# Altium schematic sheet BK1096_USB.SchDoc: =project_title
size Tabloid; PageSetup: Record=PageOptions|CenterHorizontal=True|CenterVertical=True|PrintScale=0.73|XCorrection=1.00|YCorrection=1.00|PrintKind=0|BorderSize=5000000|LeftOffset=0|BottomOffset=0|Orientation=2|PaperLength=1000|PaperWidth=1000|Scale=100|PaperSource=7|PrintQuality=-4|MediaType=1|DitherType=10|PaperKind=A4|PrintScaleMode=1; CompanyName: Luxonis Holding; Organization: Luxonis Holding; Address1: 1925 Harmony Park Drive; Address2: Westminster, CO; Address3: 80234; Address4: United States; SheetNumber: 6; SheetTotal: 6
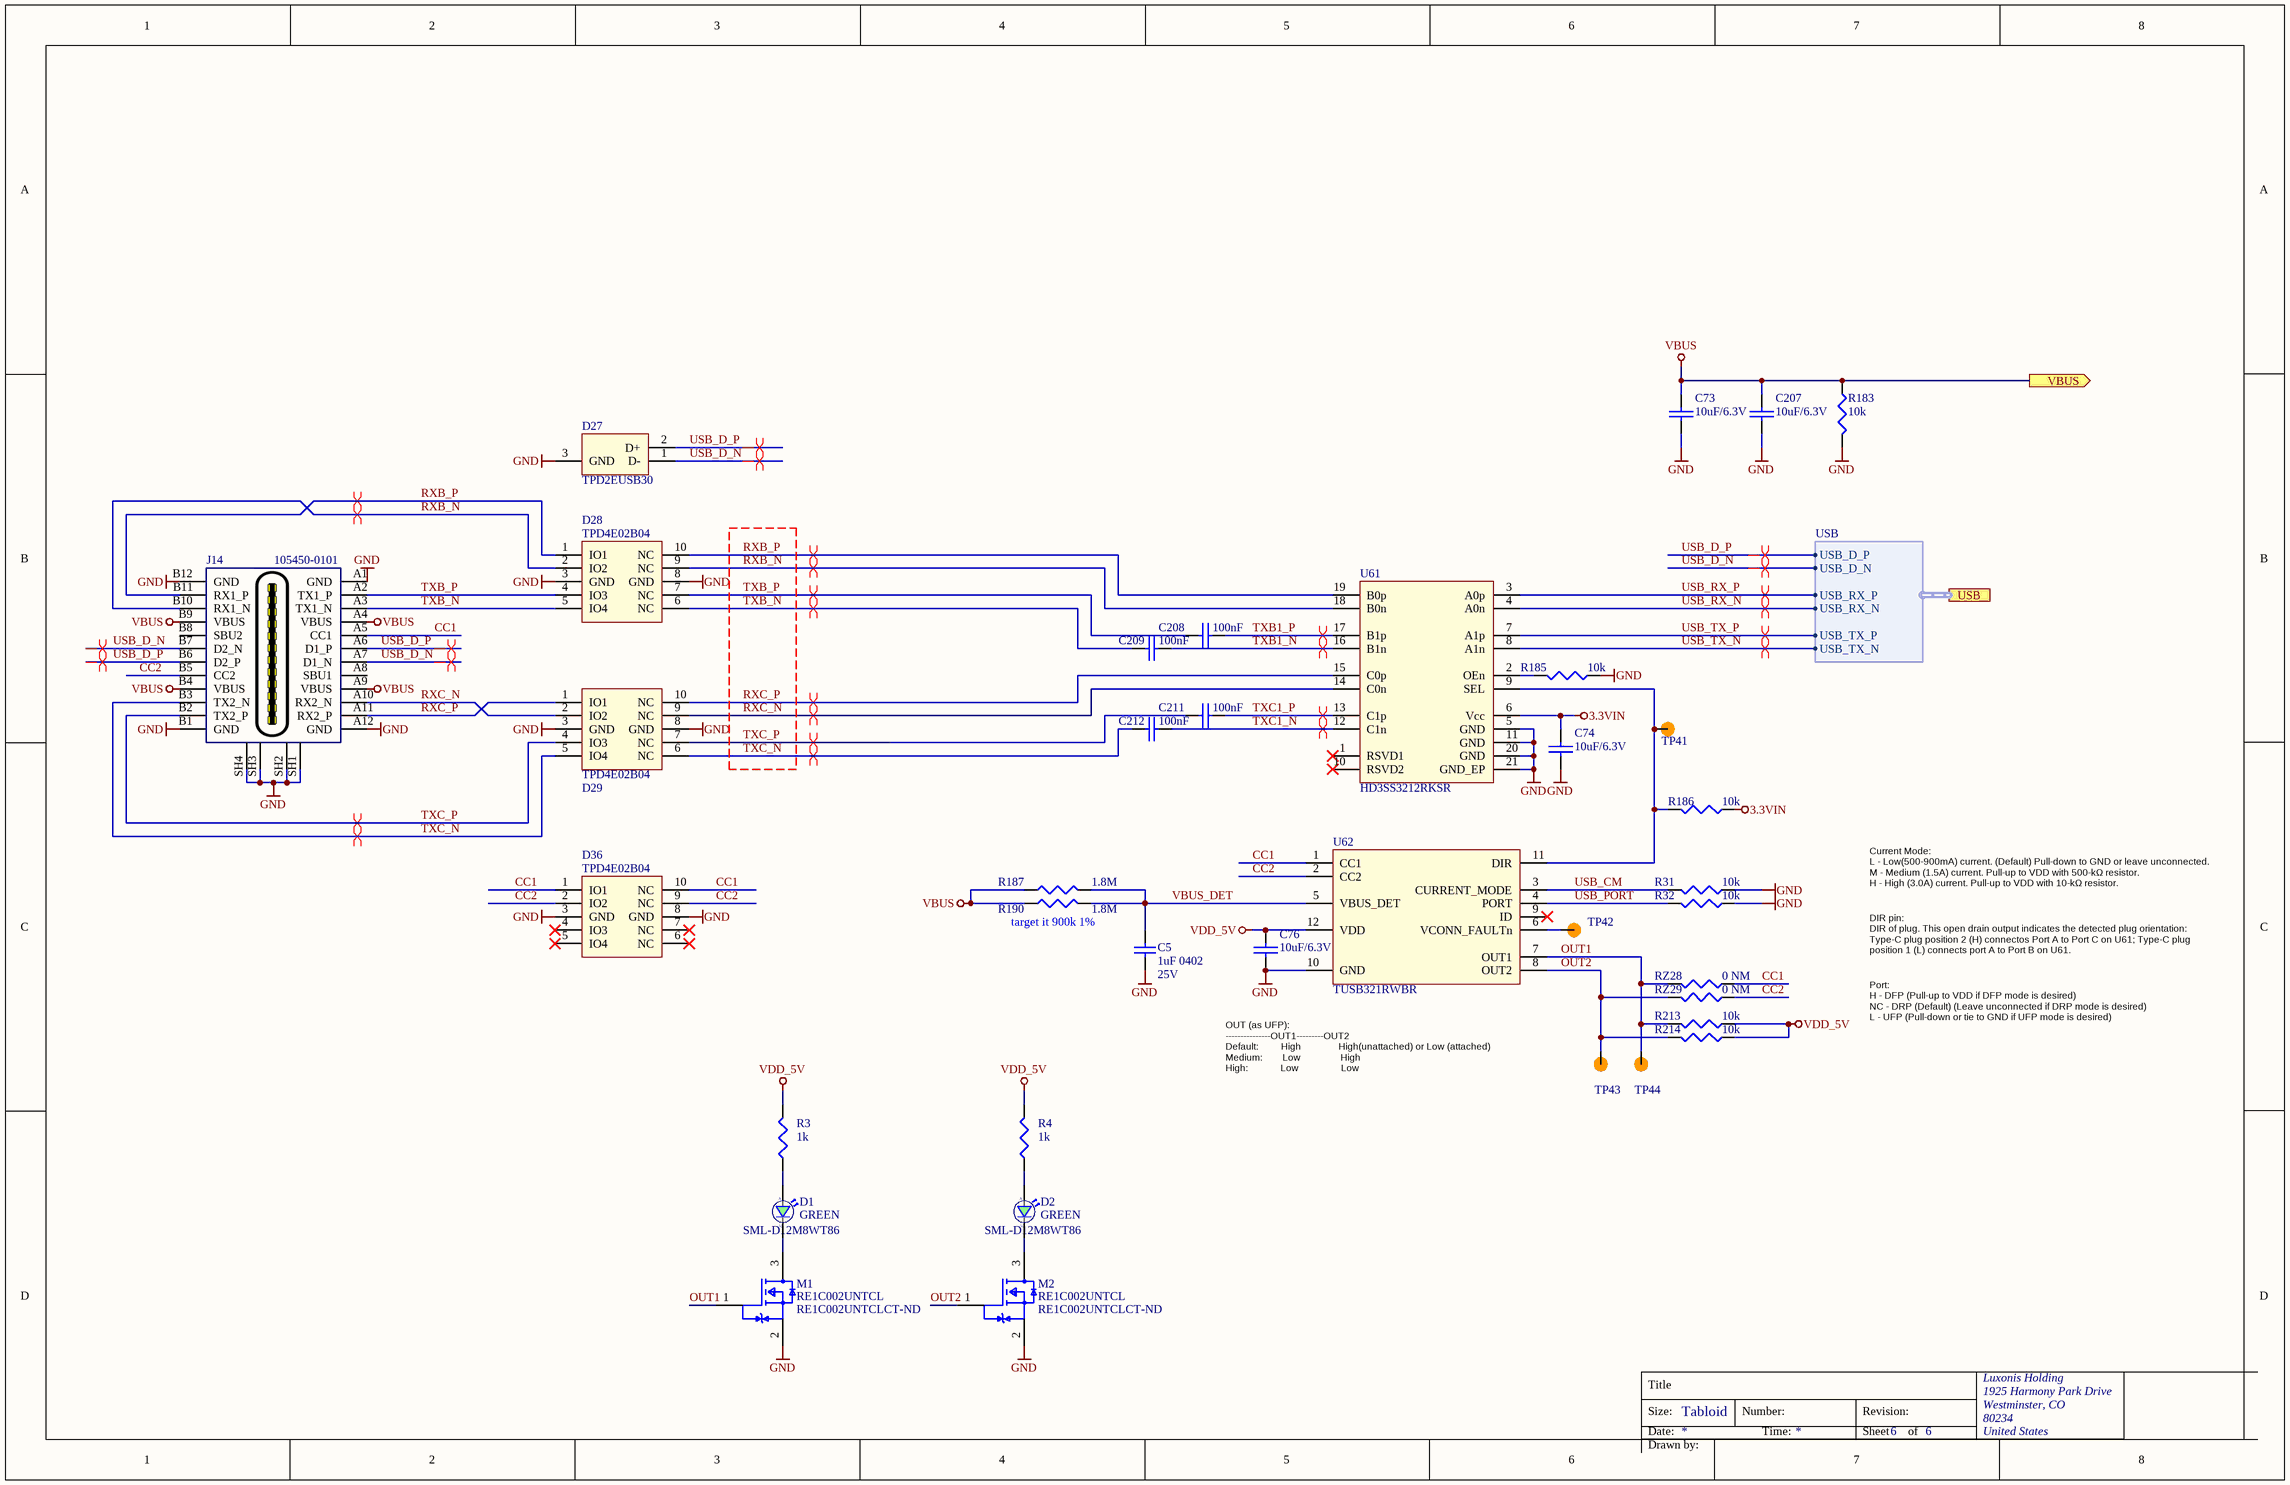
[diagram p0: BK1096_USB.SchDoc]

## Parts
C5  1uF 0402  Voltage Rating: 25V  [CAPC0402(1005)70_N]
C73  10uF/6.3V  [CAPC0402(1005)60_N]
C74  10uF/6.3V  [CAPC0402(1005)60_N]
C76  10uF/6.3V  [CAPC0402(1005)60_N]
C207  10uF/6.3V  [CAPC0402(1005)60_N]
C208  100nF  [CAPC0201(0603)33_L]
C209  100nF  [CAPC0201(0603)33_L]
C211  100nF  [CAPC0201(0603)33_L]
C212  100nF  [CAPC0201(0603)33_L]
D1  GREEN  Manufacturer Part Number: SML-D12M8WT86  [LED_0603]
D2  GREEN  Manufacturer Part Number: SML-D12M8WT86  [LED_0603]
D27  TPD2EUSB30  [SOT-3]
D28  TPD4E02B04  [DQA-10]
D29  TPD4E02B04  [DQA-10]
D36  TPD4E02B04  [DQA-10]
J14  105450-0101  [Molex_105450-0101]
M1  RE1C002UNTCL  Supplier Part Number 1: RE1C002UNTCLCT-ND  [SOT-416FL]
M2  RE1C002UNTCL  Supplier Part Number 1: RE1C002UNTCLCT-ND  [SOT-416FL]
R3  1k  [RESC0402(1005)_N]
R4  1k  [RESC0402(1005)_N]
R31  10k  [RESC0402(1005)_N]
R32  10k  [RESC0402(1005)_N]
R183  10k  [RESC0402(1005)_N]
R185  10k  [RESC0402(1005)_N]
R186  10k  [RESC0402(1005)_N]
R187  1.8M  [RESC0402(1005)_N]
R190  1.8M  [RESC0402(1005)_N]
R213  10k  [RESC0402(1005)_N]
R214  10k  [RESC0402(1005)_N]
RZ28  0 NM  [RESC0603(1608)_N]
RZ29  0 NM  [RESC0603(1608)_N]
TP41  TP_SMD  [TP_0.75MM_SMD_NO-SILK]  (value not drawn)  (no BOM)
TP42  TP_SMD  [TP_0.75MM_SMD_NO-SILK]  (value not drawn)  (no BOM)
TP43  TP_SMD  [TP_0.75MM_SMD_NO-SILK]  (value not drawn)  (no BOM)
TP44  TP_SMD  [TP_0.75MM_SMD_NO-SILK]  (value not drawn)  (no BOM)
U61  HD3SS3212RKSR  [VQFN-20]
U62  TUSB321RWBR  [X2QFN-12]

## Ports
USB (harness USB), VBUS (out)

## Harnesses
USB: USB_D_P, USB_D_N, USB_TX_N, USB_TX_P, USB_RX_N, USB_RX_P

## Nets
3.3VIN: C74.2 R186.2 U61.6(Vcc)
GND: C5.1 C73.1 C74.1 C76.1 C207.1 D27.3(GND) D28.3(GND) D28.8(GND) D29.3(GND) D29.8(GND) D36.3(GND) D36.8(GND) J14.A1(GND) J14.A12(GND) J14.B1(GND) J14.B12(GND) J14.SH1(SH) J14.SH2(SH) J14.SH3(SH) J14.SH4(SH) M1.2(Source) M2.2(Source) R31.2 R32.2 R183.1 R185.2 U61.5(GND) U61.11(GND) U61.20(GND) U61.21(GND_EP) U62.10(GND)
VBUS: C73.2 C207.2 J14.A4(VBUS) J14.A9(VBUS) J14.B4(VBUS) J14.B9(VBUS) R183.2 R187.2 R190.2 ; port VBUS
VDD_5V: C76.2 R3.2 R4.2 R213.2 R214.2 U62.12(VDD)
CC1: D36.1(IO1) D36.10(NC) J14.A5(CC1) RZ28.1 U62.1(CC1)
CC2: D36.2(IO2) D36.9(NC) J14.B5(CC2) RZ29.1 U62.2(CC2)
OUT1: M1.1(Gate) R213.1 RZ28.2 TP44.1 U62.7(OUT1)
OUT2: M2.1(Gate) R214.1 RZ29.2 TP43.1 U62.8(OUT2)
RXB_N: D28.2(IO2) D28.9(NC) J14.B10(RX1_N) U61.18(B0n)
RXB_P: D28.1(IO1) D28.10(NC) J14.B11(RX1_P) U61.19(B0p)
RXC_N: D29.2(IO2) D29.9(NC) J14.A10(RX2_N) U61.14(C0n)
RXC_P: D29.1(IO1) D29.10(NC) J14.A11(RX2_P) U61.15(C0p)
TXB1_N: C209.1 U61.16(B1n)
TXB1_P: C208.1 U61.17(B1p)
TXB_N: C209.2 D28.5(IO4) D28.6(NC) J14.A3(TX1_N)
TXB_P: C208.2 D28.4(IO3) D28.7(NC) J14.A2(TX1_P)
TXC1_N: C212.1 U61.12(C1n)
TXC1_P: C211.1 U61.13(C1p)
TXC_N: C212.2 D29.5(IO4) D29.6(NC) J14.B3(TX2_N)
TXC_P: C211.2 D29.4(IO3) D29.7(NC) J14.B2(TX2_P)
USB_CM: R31.1 U62.3(CURRENT_MODE)
USB_D_N: D27.1(D-) J14.A7(D1_N) J14.B7(D2_N) ; port USB.USB_D_N
USB_D_P: D27.2(D+) J14.A6(D1_P) J14.B6(D2_P) ; port USB.USB_D_P
USB_PORT: R32.1 U62.4(PORT)
USB_RX_N: U61.4(A0n) ; port USB.USB_RX_N
USB_RX_P: U61.3(A0p) ; port USB.USB_RX_P
USB_TX_N: U61.8(A1n) ; port USB.USB_TX_N
USB_TX_P: U61.7(A1p) ; port USB.USB_TX_P
VBUS_DET: C5.2 R187.1 R190.1 U62.5(VBUS_DET)
NetD1_1: D1.1(C) M1.3(Drain)
NetD1_2: D1.2(A) R3.1
NetD2_1: D2.1(C) M2.3(Drain)
NetD2_2: D2.2(A) R4.1
NetR185_1: R185.1 U61.2(OEn)
NetR186_1: R186.1 TP41.1 U61.9(SEL) U62.11(DIR)
NetTP42_1: TP42.1 U62.6(VCONN_FAULTn)

Not connected (* = marked no-connect by the designer): D36 4(IO3)* 5(IO4)* 6(NC)* 7(NC)*; J14 A8(SBU1) B8(SBU2); U61 1(RSVD1)* 10(RSVD2)*; U62 9(ID)*

## Layout directives
differential pair; differential pair class USB3: RXB_N, RXB_P, RXC_N, RXC_P, TXB1_N, TXB1_P, TXB_N, TXB_P, TXC1_N, TXC1_P, TXC_N, TXC_P, USB_RX_N, USB_RX_P, USB_TX_N, USB_TX_P
differential pair; differential pair class USB_D: USB_D_N, USB_D_P

## Notes on the sheet
- Current Mode:
  L - Low(500-900mA) current. (Default) Pull-down to GND or leave unconnected.
  M - Medium (1.5A) current. Pull-up to VDD with 500-kΩ resistor.
  H - High (3.0A) current. Pull-up to VDD with 10-kΩ resistor.
- (near R190) target it 900k 1%
- DIR pin:
  DIR of plug. This open drain output indicates the detected plug orientation: Type-C plug position 2 (H) connectos Port A to Port C on U61; Type-C plug position 1 (L) connects port A to Port B on U61.
- Port:
  H - DFP (Pull-up to VDD if DFP mode is desired)
  NC - DRP (Default) (Leave unconnected if DRP mode is desired)
  L - UFP (Pull-down or tie to GND if UFP mode is desired)
- OUT (as UFP):
  ---------------OUT1---------OUT2
  Default:         High               High(unattached) or Low (attached)
  Medium:        Low                High
  High:             Low                 Low
- Title
- Size:
- Date:
- Tabloid
- Number:
- Time:
- Revision:
- Sheet
- of
- Drawn by:

## Library data of the parts
C5 = GRM155R61E105KA12D: CAP CER 1UF 25V X5R 0402 10%; Manufacturer 1: Murata; Material: Ceramic; Supplier 1: Digi-Key; Manufacturer Part Number 1: GRM155R61E105KA12D; Stock 1: 200653; Pricing 1: 1=0.10000, 10=0.07100, 100=0.03350, 500=0.02352, 1000=0.01947, 2500=0.01812, 5000=0.01658 (USD); RoHS: Yes; Mount: Surface Mount; Case/Package: 0402; Weight: 0.000212oz; Case Code (Metric): 1005; Case Code (Imperial): 0402; Min Operating Temperature: -55°C; Max Operating Temperature: 85°C; Tolerance: 10%; Capacitance: 1uF; Dielectric: X5R; Voltage Rating (DC): 25V; Packaging: Tape and Reel; Package Quantity: 10000; Termination: SMD/SMT; Voltage: 25V; Length: 1mm; Height: 0.5mm; Width: 0.5mm; Thickness: 0.022inch; Depth: 0.5mm; Lead Free: Lead Free; REACH SVHC: No SVHC; ComponentLink1URL: https://datasheet.ciiva.com/22732/1666664-22732122.pdf?src-supplier=Element14; ComponentLink1Description: https://datasheet.ciiva.com/22732/1666664-22732122.pdf?src-supplier=Element14; ComponentLink2URL: https://datasheet.ciiva.com/7719/1666664-7719006.pdf?src-supplier=Element14; ComponentLink2Description: https://datasheet.ciiva.com/7719/1666664-7719006.pdf?src-supplier=Element14; Supplier Part Number 1: 490-10017-1-ND; Supplier 2: Arrow; Supplier 3: TTI; Supplier Part Number 2: GRM155R61E105KA12D; Supplier Part Number 3: GRM155R61E105KA12D
C73 C74 C76 C207 = CAP: SMD Multilayer Ceramic Capacitor, 0402 [1005 Metric], 10 µF, 6.3 V, ± 20%, X5R; E - MFG: MuRata; F - MFG P/N: GRM155R60J106ME44D; D - my Footprint: CAPC0402(1005)60_N
C208 C209 C211 C212 = CAP: SMD Multilayer Ceramic Capacitor, 0201 [0603 Metric], 0.1 µF, 6.3 V, ± 10%, X5R; B - Value: 0.1uF; C - Notes: 0201  0.1 µF, 6.3 V, ± 10%, X5R; E - MFG: MuRata; F - MFG P/N: GRM033R60J104KE19D; D - my Footprint: CAPC0201(0603)33_L
D1 D2 = LED_GREEN_0603: LED GREEN DIFFUSED 0603 SMD; Manufacturer: Rohm; Colour: Green,Yellow; Lens Colour: White,Clear,Diffused; Lens Style: Diffused,Colorless,Rectangular; Forward Current: 20mA; Forward Voltage: 2.2V; Luminous Intensity: 25mcd; Dominant Wavelength: 572nm; Number of LEDs: 1; Viewing Angle: 160°; Supplier 1: Mouser; Stock 1: 109326; Pricing 1: 1=0.32, 10=0.216, 50=0.216, 100=0.09, 1000=0.062, 10000=0.041 (USD); Mount: Surface Mount; Case/Package: 0603; Number of Pins: 2; Case Code (Metric): 1608; Case Code (Imperial): 0603; Min Operating Temperature: -40°C; Max Operating Temperature: 85°C; Packaging: Tape and Reel; Wavelength: 572nm; Illumination Colour: Green; Package Quantity: 1; Test Current: 20mA; Lens Transparency: Diffused; Length: 1.6mm; Height: 0.65mm; Width: 0.8mm; Radiation Hardening: No; REACH SVHC: Unknown; Lead Free: Lead Free; ComponentLink1URL: https://datasheet.ciiva.com/11774/0900766b80df3ada-11774260.pdf; ComponentLink1Description: https://datasheet.ciiva.com/11774/0900766b80df3ada-11774260.pdf; ComponentLink2URL: https://datasheet.ciiva.com/3161/sml-d1-3161419.pdf; ComponentLink2Description: https://datasheet.ciiva.com/3161/sml-d1-3161419.pdf; ComponentLink3URL: https://datasheet.ciiva.com/2110/sml-d1-2110396.pdf; ComponentLink3Description: https://datasheet.ciiva.com/2110/sml-d1-2110396.pdf; ComponentLink4URL: https://datasheet.ciiva.com/2110/sml-d1-2110397.pdf; ComponentLink4Description: https://datasheet.ciiva.com/2110/sml-d1-2110397.pdf; ComponentLink5URL: https://datasheet.ciiva.com/2110/sml-d1-2110398.pdf; ComponentLink5Description: https://datasheet.ciiva.com/2110/sml-d1-2110398.pdf
D27 = TPD2EUSB30: DIODE, ESD, DUAL, USB3.0, SOT-3; E - MFG: TI; F - MFG P/N: TPD2EUSB30ADRTR; D - my Footprint: SOT-3
D28 D29 D36 = TPD4E02B04: TVS DIODE 3.6VWM 8.8VC 10USON; E - MFG: TI; F - MFG P/N: TPD4E02B04DQAR; D - my Footprint: DQA-10
J14 = Molex_1054500101: USB 3.1 Type C Receptacle SMD RA; E - MFG: Molex; D - my Footprint: Molex_105450-0101; F - MFG P/N: 105450-0101
M1 M2 = RE1C002UNTCL: MOSFET N-CH 20V 0.2A EMT3; Manufacturer 1: Rohm; Continuous Drain Current (ID): 200mA; Rds On Max: 1.2R; Input Capacitance: 25pF; Max Power Dissipation: 150mW; Supplier 1: Digi-Key; Manufacturer Part Number 1: RE1C002UNTCL; Stock 1: 941425; Pricing 1: 1=0.20000, 10=0.18200, 100=0.09930, 500=0.06112, 1000=0.04167 (USD); RoHS: Yes; Mount: Surface Mount; Case/Package: SOT-89; Packaging: Tape and Reel; Drain to Source Voltage (Vdss): 20V; Lead Free: Lead Free; ComponentLink1URL: http://www.mouser.com/ds/2/348/re1c002untcl-e-1018231.pdf?src-supplier=Mouser; ComponentLink1Description: http://www.mouser.com/ds/2/348/re1c002untcl-e-1018231.pdf?src-supplier=Mouser; ComponentLink2URL: http://rohmfs.rohm.com/en/techdata_basic/transistor/taping/EMT3_TL_taping.pdf?src-supplier=Digi-Key; ComponentLink2Description: http://rohmfs.rohm.com/en/techdata_basic/transistor/taping/EMT3_TL_taping.pdf?src-supplier=Digi-Key; ComponentLink3URL: http://rohmfs.rohm.com/en/products/databook/datasheet/discrete/transistor/mosfet/re1c002un.pdf?src-supplier=Avnet; ComponentLink3Description: http://rohmfs.rohm.com/en/products/databook/datasheet/discrete/transistor/mosfet/re1c002un.pdf?src-supplier=Avnet; ComponentLink4URL: https://www.rohm.com/datasheet/RE1C002UN/re1c002untcl-e?src-supplier=Digi-Key; ComponentLink4Description: https://www.rohm.com/datasheet/RE1C002UN/re1c002untcl-e?src-supplier=Digi-Key; ComponentLink5URL: http://www.farnell.com/datasheets/2704376.pdf?src-supplier=Newark; ComponentLink5Description: http://www.farnell.com/datasheets/2704376.pdf?src-supplier=Newark
R3 R4 = RES1: SMD Chip Resistor, 1 kohm, 50 V, 0402 [1005 Metric], 62.5 mW, ± 1%; E - MFG: WALSIN; F - MFG P/N: WR04X1001FTL; D - my Footprint: RESC0402(1005)_N
R31 R32 R183 R185 R186 R213 R214 = RES1: SMD Chip Resistor, Thick Film, 10 kohm, 50 V, 0402, 100mW, ± 1%; E - MFG: Panasonic; F - MFG P/N: ERJ2RKF1002X; D - my Footprint: RESC0402(1005)_N
R187 R190 = R_1.8M_1%_0402: RES SMD 1.8M 1% 0402 50V; E - MFG: YAGEO (PHYCOMP); F - MFG P/N: RC0402FR-071M8L; D - my Footprint: RESC0402(1005)_N
RZ28 RZ29 = RES1: Thick Film Resistors - SMD 0603 Zero Ohms; E - MFG: Panasonic; F - MFG P/N: ERJ-3GEY0R00V; D - my Footprint: RESC0603(1608)_N
TP41-TP44 = TP_SMD: circular pad test point, SMD
U61 = HD3SS3212RKSR: Two Channel Differential 2:1/1:2 10Gbps Mux/Demux; E - MFG: TEXAS INSTRUMENTS; D - my Footprint: VQFN-20; F - MFG P/N: HD3SS3212RKSR
U62 = TUSB321RWBR: USB Type-C  ™ Configuration  Channel  Logic and Port Control  with VCONN; E - MFG: TI; D - my Footprint: X2QFN-12; F - MFG P/N: TUSB321RWBR